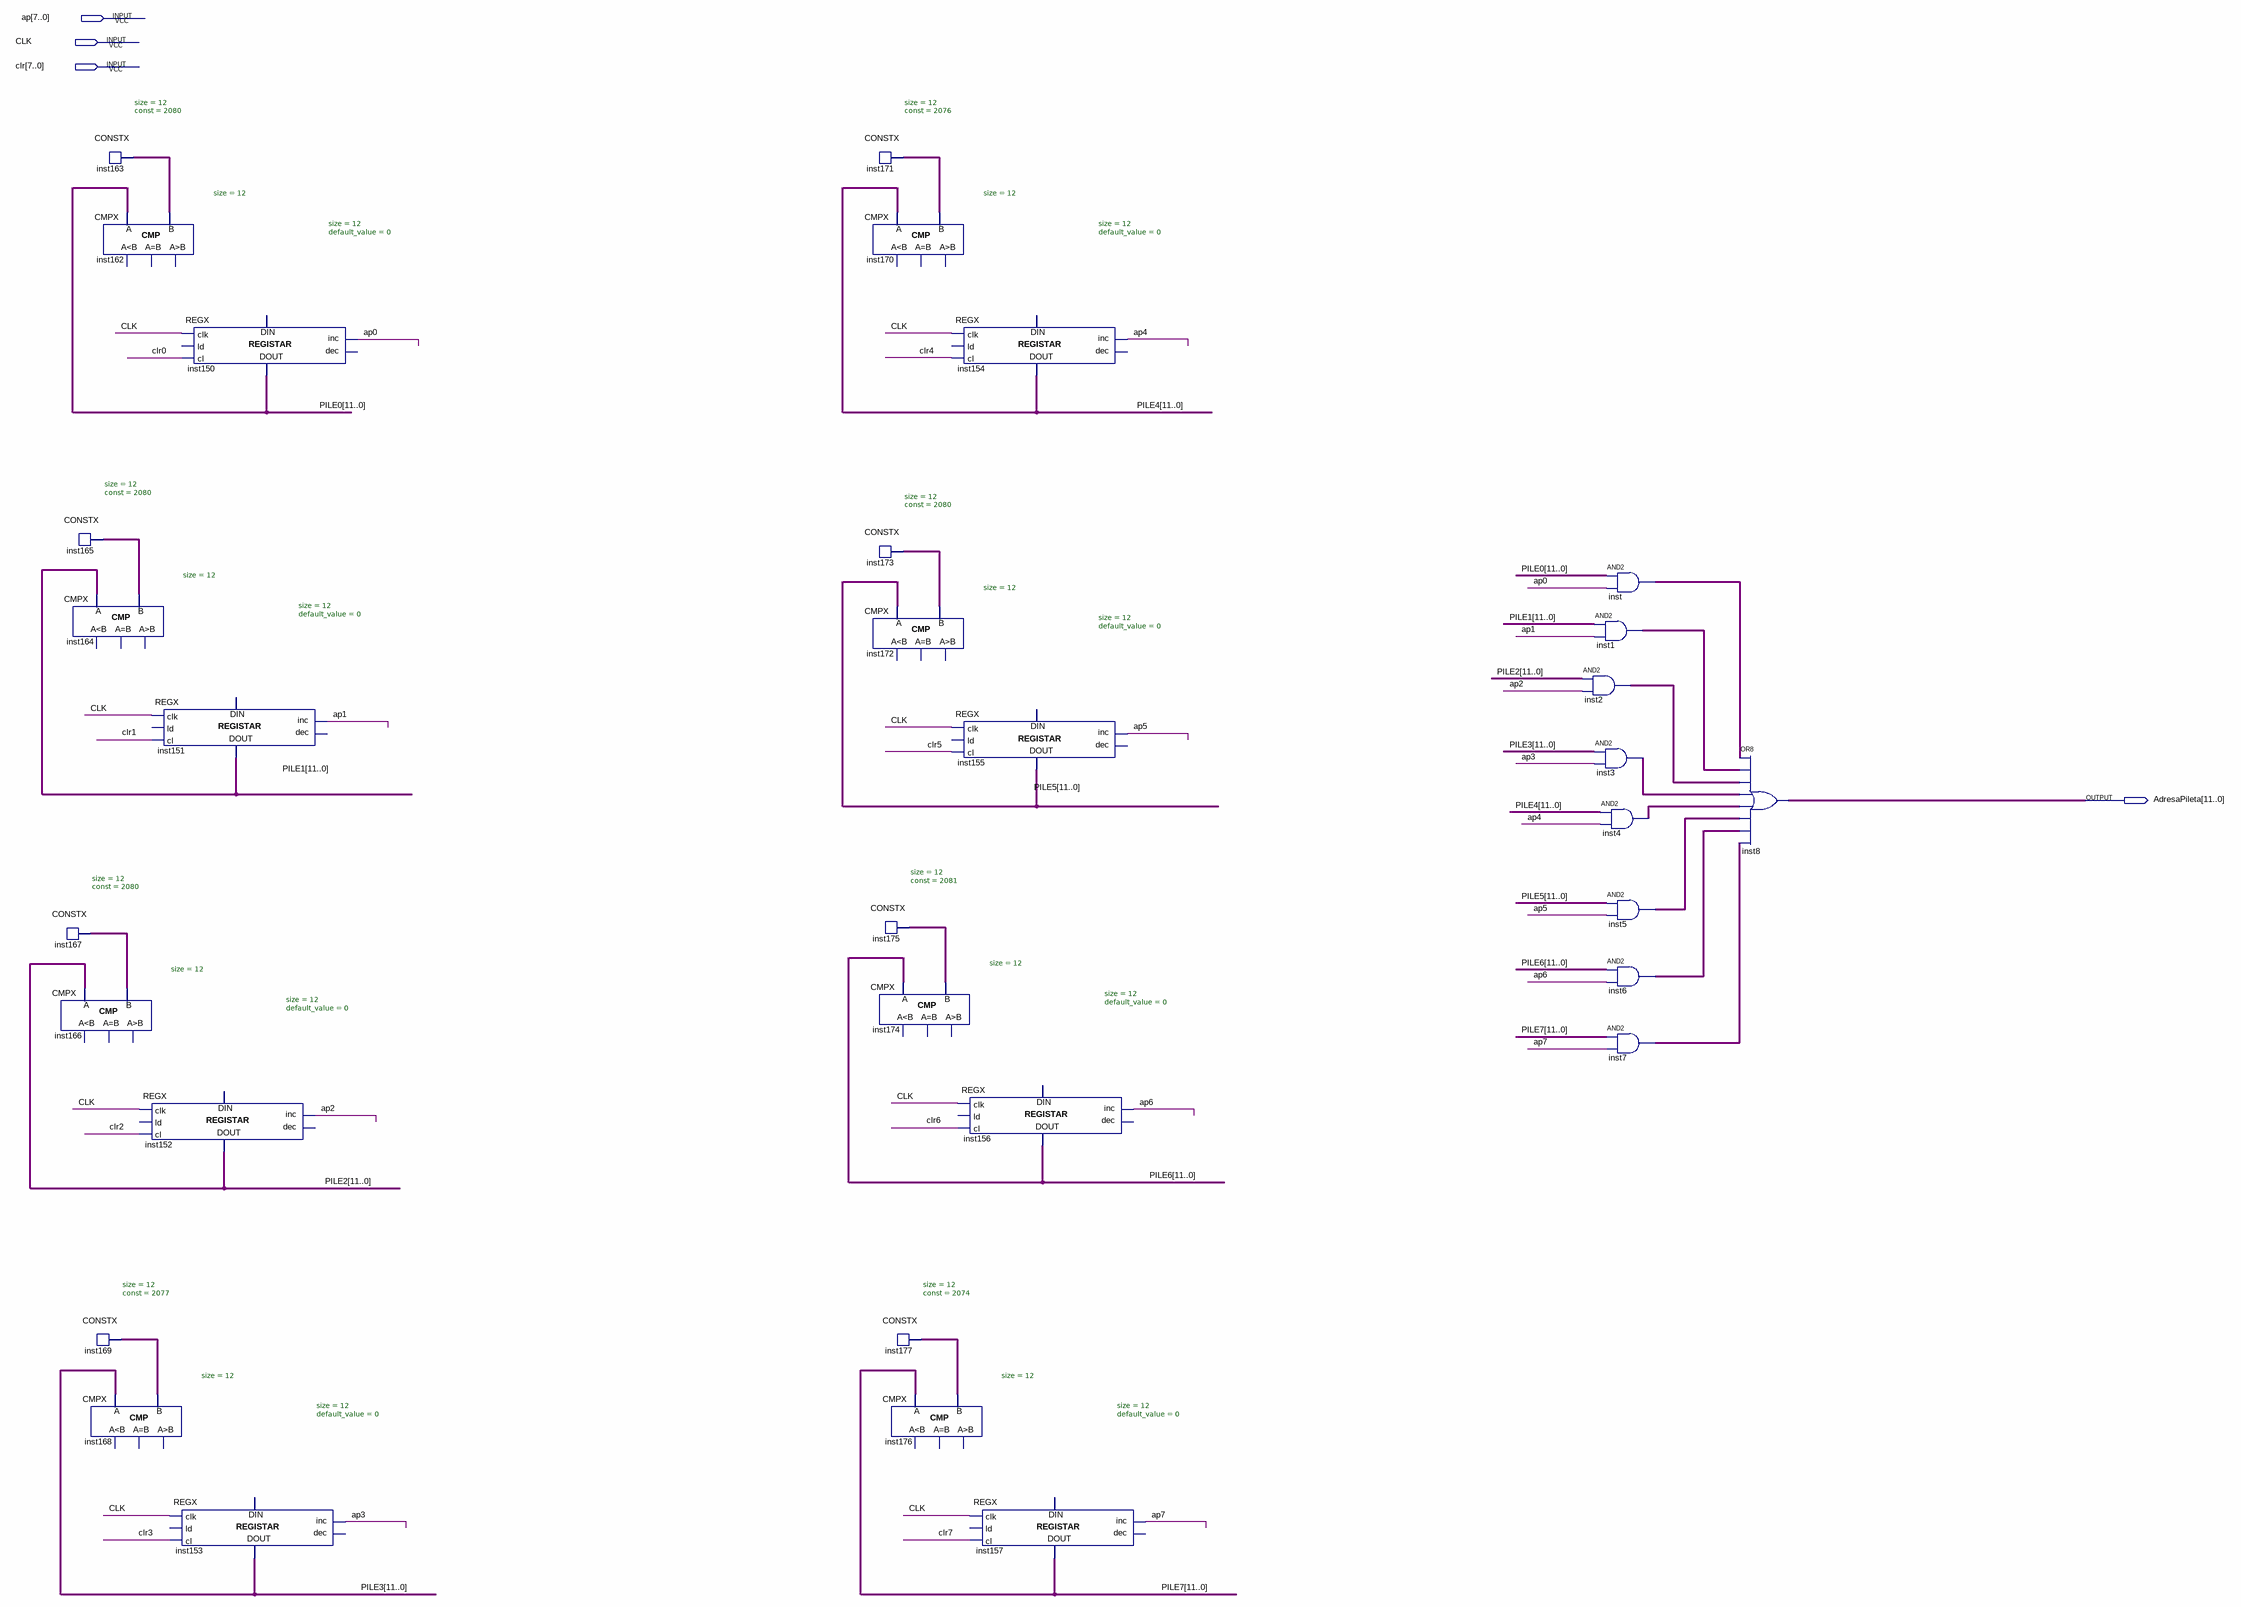
[diagram p0: schematic sheet]
// Quartus schematic BojaPileta.bdf as structural Verilog: 33 symbols, 4 pins
module BojaPileta (
  input  [7:0] ap,
  input  CLK,
  input  [7:0] clr,
  output [11:0] AdresaPileta
);

  wire [11:0] inst1_out, inst2_out, inst3_out, inst4_out, inst5_out, inst6_out, inst7_out, inst163_data,
       inst165_data, inst167_data, inst169_data, inst171_data, inst173_data, inst175_data, inst177_data,
       inst_out, PILE0, PILE1, PILE2, PILE3, PILE4, PILE5, PILE6, PILE7;

  CONSTX #(.size(12), .\const (2080)) inst165 (.data(inst165_data));
  CMPX #(.size(12)) inst164 (.A(PILE1), .B(inst165_data));  // open: ls, eq, gr
  CONSTX #(.size(12), .\const (2080)) inst167 (.data(inst167_data));
  CMPX #(.size(12)) inst166 (.A(PILE2), .B(inst167_data));  // open: ls, eq, gr
  CONSTX #(.size(12), .\const (2080)) inst163 (.data(inst163_data));
  CMPX #(.size(12)) inst162 (.A(PILE0), .B(inst163_data));  // open: ls, eq, gr
  CONSTX #(.size(12), .\const (2077)) inst169 (.data(inst169_data));
  CMPX #(.size(12)) inst168 (.A(PILE3), .B(inst169_data));  // open: ls, eq, gr
  REGX #(.size(12), .default_value(0)) inst151 (
    .clk(CLK), .cl(clr[1]), .inc(ap[1]), .data_out(PILE1));  // open: ld, dec, data_in
  REGX #(.size(12), .default_value(0)) inst152 (
    .clk(CLK), .cl(clr[2]), .inc(ap[2]), .data_out(PILE2));  // open: ld, dec, data_in
  REGX #(.size(12), .default_value(0)) inst150 (
    .clk(CLK), .cl(clr[0]), .inc(ap[0]), .data_out(PILE0));  // open: ld, dec, data_in
  REGX #(.size(12), .default_value(0)) inst153 (
    .clk(CLK), .cl(clr[3]), .inc(ap[3]), .data_out(PILE3));  // open: ld, dec, data_in
  CONSTX #(.size(12), .\const (2076)) inst171 (.data(inst171_data));
  CMPX #(.size(12)) inst170 (.A(PILE4), .B(inst171_data));  // open: ls, eq, gr
  CONSTX #(.size(12), .\const (2080)) inst173 (.data(inst173_data));
  CMPX #(.size(12)) inst172 (.A(PILE5), .B(inst173_data));  // open: ls, eq, gr
  CONSTX #(.size(12), .\const (2081)) inst175 (.data(inst175_data));
  CMPX #(.size(12)) inst174 (.A(PILE6), .B(inst175_data));  // open: ls, eq, gr
  CONSTX #(.size(12), .\const (2074)) inst177 (.data(inst177_data));
  CMPX #(.size(12)) inst176 (.A(PILE7), .B(inst177_data));  // open: ls, eq, gr
  REGX #(.size(12), .default_value(0)) inst154 (
    .clk(CLK), .cl(clr[4]), .inc(ap[4]), .data_out(PILE4));  // open: ld, dec, data_in
  REGX #(.size(12), .default_value(0)) inst155 (
    .clk(CLK), .cl(clr[5]), .inc(ap[5]), .data_out(PILE5));  // open: ld, dec, data_in
  REGX #(.size(12), .default_value(0)) inst156 (
    .clk(CLK), .cl(clr[6]), .inc(ap[6]), .data_out(PILE6));  // open: ld, dec, data_in
  REGX #(.size(12), .default_value(0)) inst157 (
    .clk(CLK), .cl(clr[7]), .inc(ap[7]), .data_out(PILE7));  // open: ld, dec, data_in
  assign inst_out = PILE0 & {12{ap[0]}};  // AND2 inst, 12 bits wide
  assign inst1_out = PILE1 & {12{ap[1]}};  // AND2 inst1, 12 bits wide
  assign inst2_out = PILE2 & {12{ap[2]}};  // AND2 inst2, 12 bits wide
  assign inst3_out = PILE3 & {12{ap[3]}};  // AND2 inst3, 12 bits wide
  assign inst4_out = PILE4 & {12{ap[4]}};  // AND2 inst4, 12 bits wide
  assign inst5_out = PILE5 & {12{ap[5]}};  // AND2 inst5, 12 bits wide
  assign inst6_out = PILE6 & {12{ap[6]}};  // AND2 inst6, 12 bits wide
  assign inst7_out = PILE7 & {12{ap[7]}};  // AND2 inst7, 12 bits wide
  assign AdresaPileta = inst_out | inst1_out | inst2_out | inst3_out | inst4_out | inst5_out | inst6_out | inst7_out;  // OR8 inst8, 12 bits wide
endmodule
